# EAGLE design LB_BIT_i6_DIMMER-v02(rev1) (EAGLE 6.1)
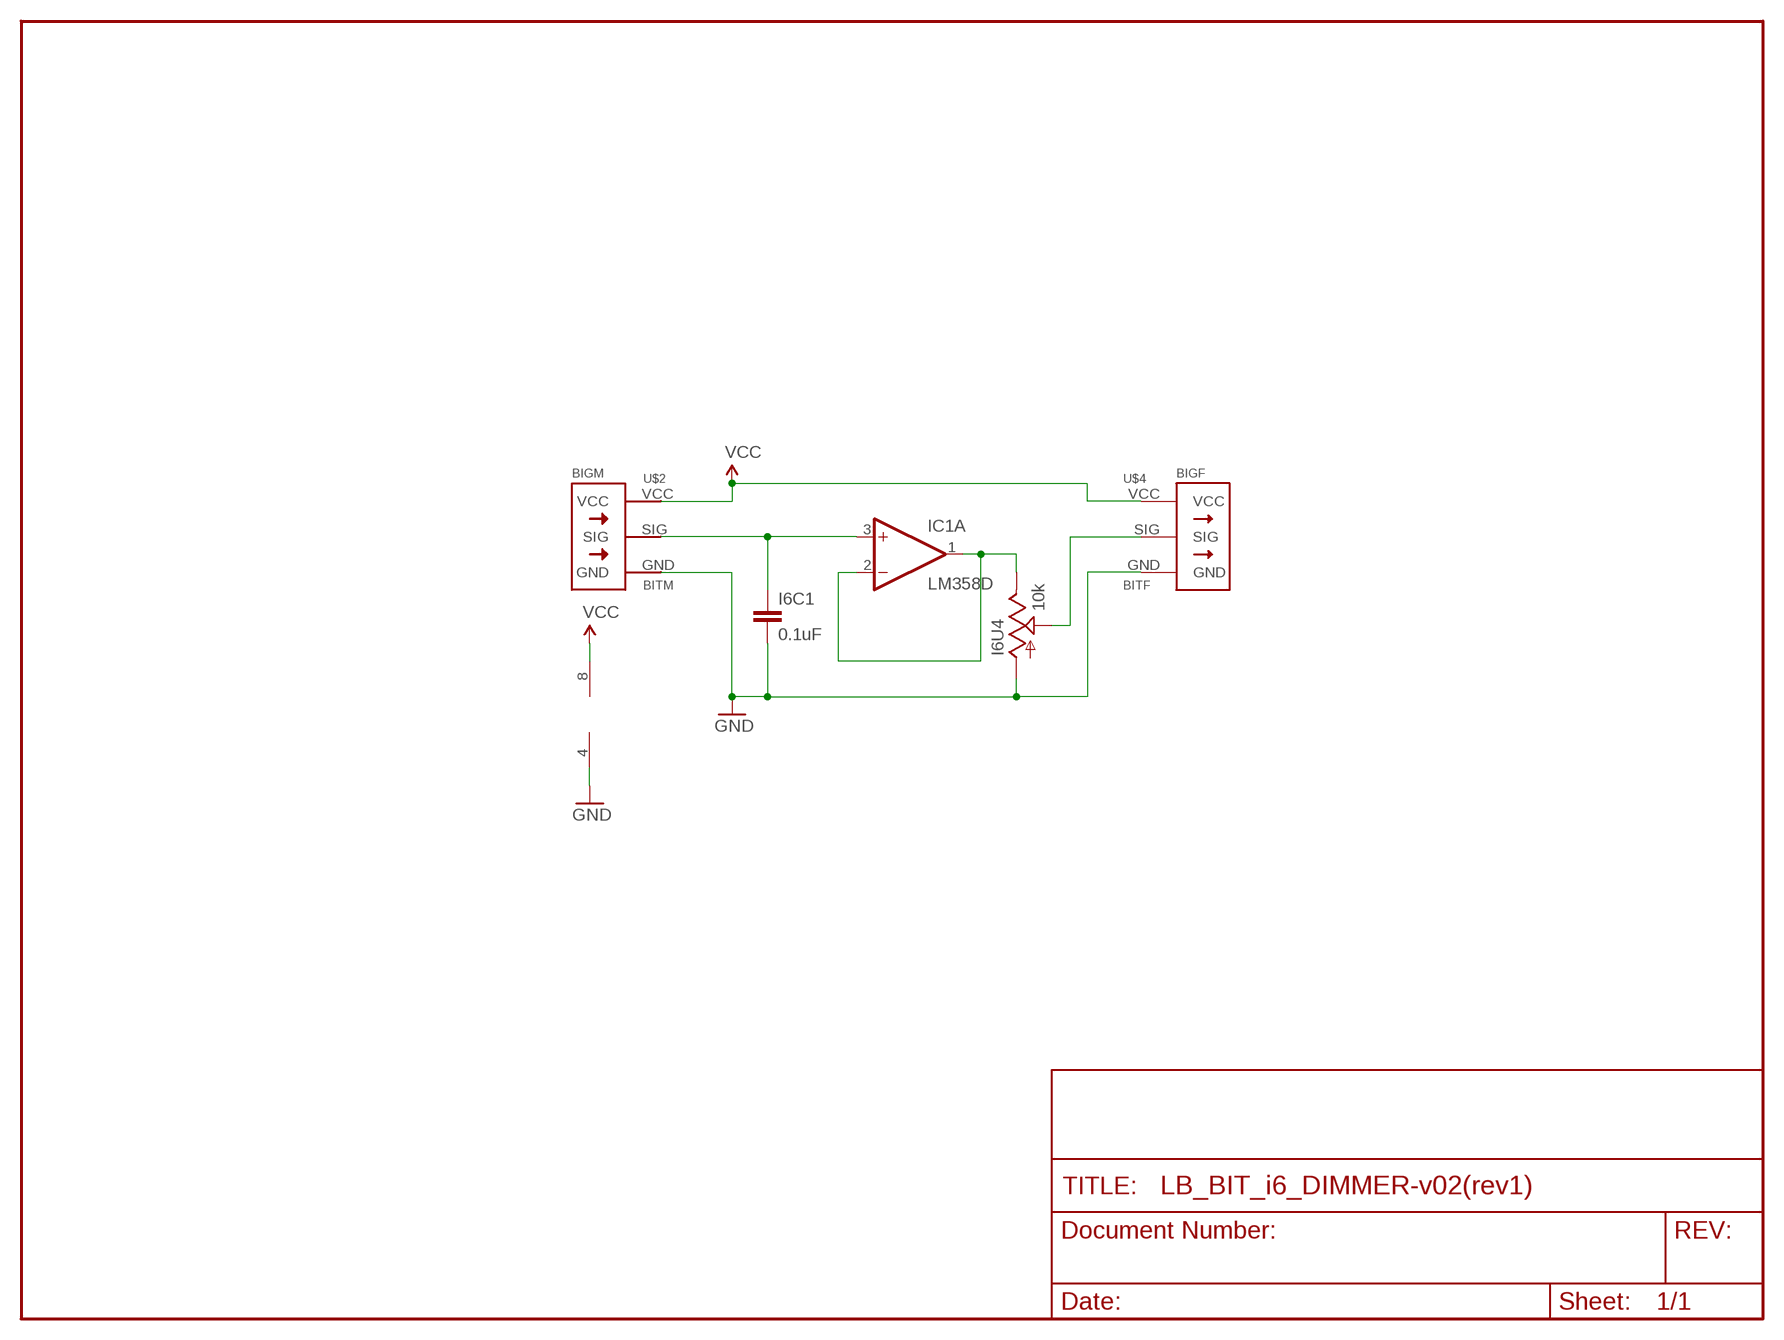
[diagram p0: schematic, sheet 1]

## Parts
I6C1  0.1uF  CAP1206  [1206]
I6U4  10k  POT-RV16AF-20  [POT_ALPHA_RV16AF-20]
IC1  LM358D  [SO08]
U$2  BITM  [BITM]
U$4  BITF  [BITM]

## Nets
GND: I6C1.2 I6U4.1(A) IC1.4(P:V-) U$2.GND U$4.GND
N$1: I6U4.3(E) IC1.1(A:OUT) IC1.2(A:-IN)
POT: I6U4.2(S) U$4.SIG
SIG: I6C1.1 IC1.3(A:+IN) U$2.SIG
VCC: IC1.8(P:V+) U$2.VCC U$4.VCC
Unconnected: IC1.5(B:+IN) IC1.6(B:-IN) IC1.7(B:OUT)

## Library data of the parts
I6C1 = SparkFun:CAP: Capacitor Standard 0603 ceramic capacitor, and 0.1" leaded capacitor.
I6U4 = SparkFun:POT
IC1 = linear:LM358: OP AMP also LM158; LM258; LM2904 Source: http://cache.national.com/ds/LM/LM158.pdf
U$2 = radames:BITM
U$4 = radames:BITF

## Board
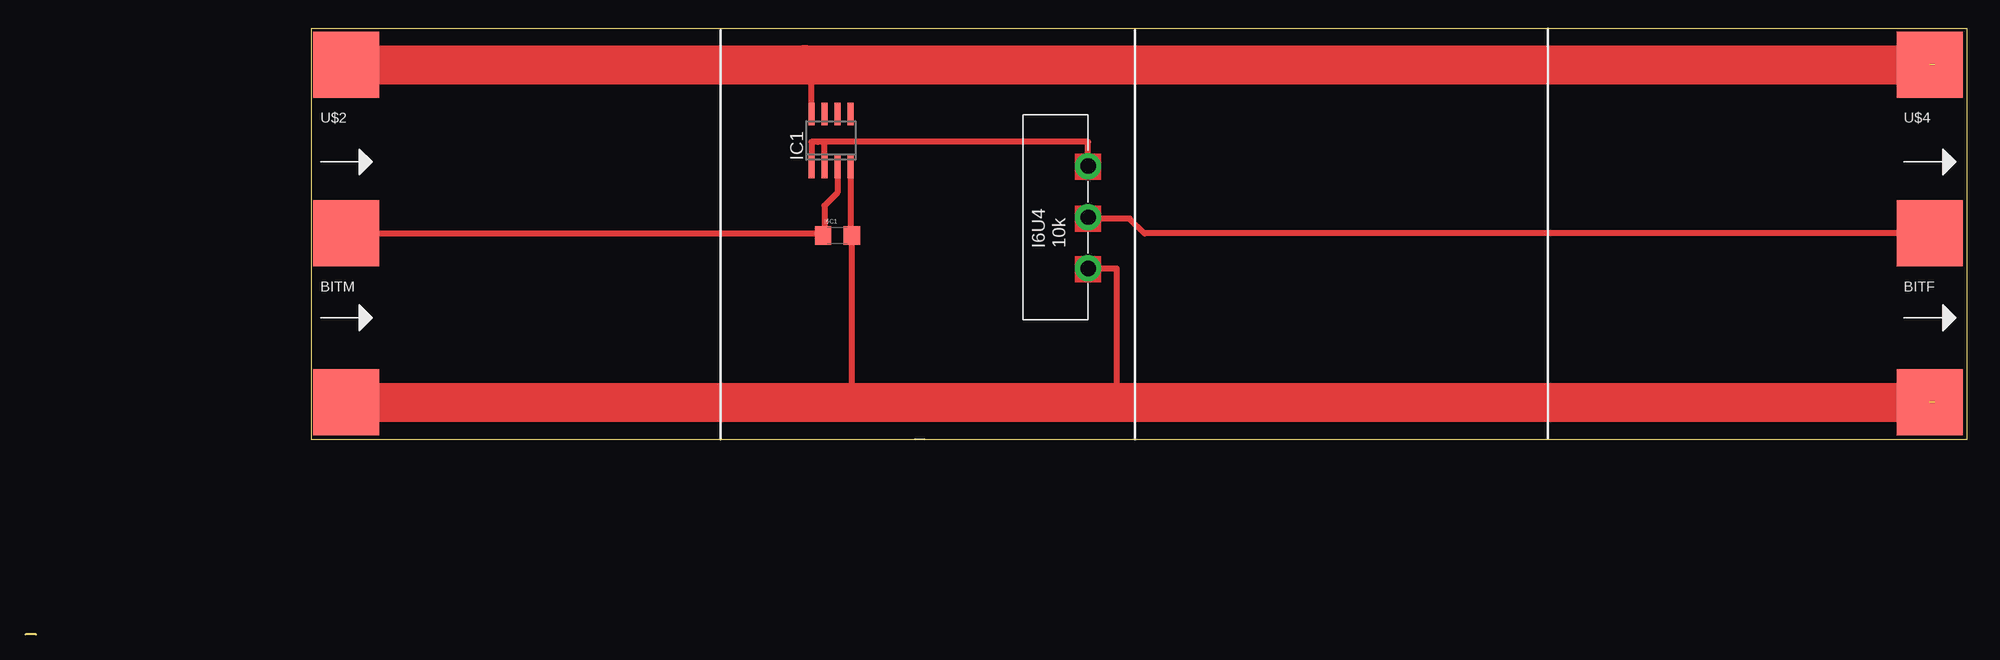
[diagram p1: board, top side]

Size 189.85 x 59.21 mm. Coordinates in mm from the lower left corner, seen from the top.
Outline: 1.02,0 0,0
Outline: 27.94,19.05 189.85,19.05 189.85,59.21 27.94,59.21 27.94,19.05
Copper layers (1*16): Top 0.035mm / dielectric 1.5mm / Bottom 0.035mm
Design rules: minimum track width 8mil, minimum drill 20mil, track to track 8mil, track to pad 8mil, pad to pad 8mil, via to via 8mil, smd to smd 8mil, copper to edge 10mil, drill to drill 8mil, minimum pad ring 12mil, minimum via ring 10mil, stop-mask expansion 4mil, vias tented up to drill 25mil, thermal gap 10mil

### Footprints (pad centres in the part's own frame; a part is rotated, then mirrored left to right if it is on the bottom)
1206 = smd 1.6 x 1.8: 1 -1.4,0; 2 1.4,0
POT_ALPHA_RV16AF-20 = drill 1.5 pad 2.54: 1 -5,-3.175; 2 0,-3.175; 3 5,-3.175
SO08 = smd 0.6 x 2.2: 1 -1.905,-2.6; 2 -0.635,-2.6; 3 0.635,-2.6; 4 1.905,-2.6; 5 1.905,2.6; 6 0.635,2.6; 7 -0.635,2.6; 8 -1.905,2.6
BITM = smd 6.452 x 6.452: GND 3.175,-16.192; SIG 3.175,0.318; VCC 3.175,16.828

### Placement (x,y rotation side)
I6C1  79.38,38.99 0 top
I6U4  100.71,40.77 90 top
IC1  78.74,48.26 0 top
U$2  28.19,38.86 0 top
U$4  183.01,38.86 0 top

### Tracks (layer width: path | path; a pad name or v marks a point on that pad's centre or on a via)
GND  (1 unrouted)
  Top 0.61: IC1.4 80.64,39.12 arc90 I6C1.2 80.78,22.67 81.28,22.67 | I6U4.1 106.68,35.77 106.68,22.67
  Top 3.81: U$2.GND 81.28,22.67 106.68,22.67 186.69,22.67 186.69,22.86
N$1
  Top 0.61: I6U4.3 103.89,48.13 78.11,48.13 | IC1.1 76.83,48.13 77.47,48.13 78.11,48.13 | IC1.2 78.11,48.13
POT
  Top 0.61: U$4.SIG 109.41,39.18 107.95,40.64 104.01,40.64 I6U4.2
SIG
  Top 0.61: IC1.3 79.38,43.18 78.11,41.91 78.11,39.12 I6C1.1 77.78,39.18 U$2.SIG
VCC  (1 unrouted)
  Top 0.61: IC1.8 76.83,55.05 arc90 76.2,55.69
  Top 3.81: U$2.VCC 76.2,55.69 186.69,55.69 186.69,54.61
(copper drawn outside any net)
  shapes: Top area x3